# Altium project Battery Management System.PrjPcb (part 2 of 2)

## Sheet SH4 - MICROCONTROLLER.SchDoc: MCU
size Letter; DrawnBy: Ayesha Ebrahim; Revision: 1; SheetNumber: 4
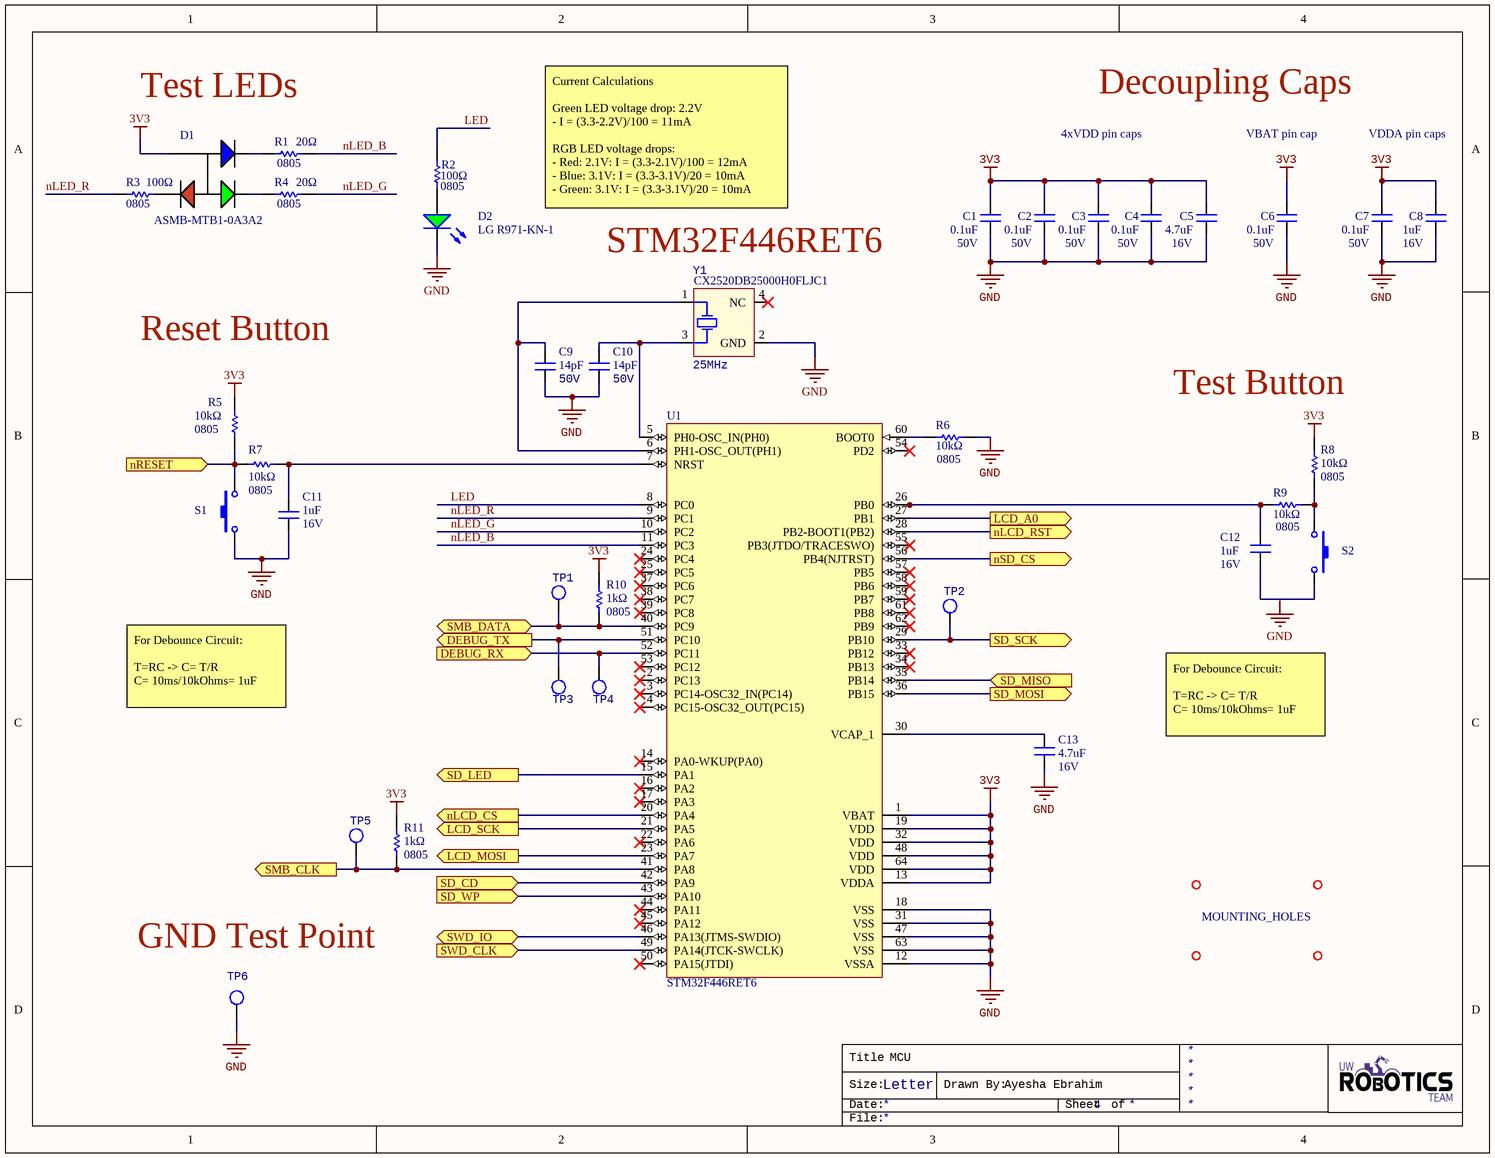
[diagram p3: SH4 - MICROCONTROLLER.SchDoc]

### Parts
C1  value 0.1uF  Voltage Rating: 50V  [CAPC2012X140N]  (hidden comment: CAP_0.1uF_50V_0805)
C2  value 0.1uF  Voltage Rating: 50V  [CAPC2012X140N]  (hidden comment: CAP_0.1uF_50V_0805)
C3  value 0.1uF  Voltage Rating: 50V  [CAPC2012X140N]  (hidden comment: CAP_0.1uF_50V_0805)
C4  value 0.1uF  Voltage Rating: 50V  [CAPC2012X140N]  (hidden comment: CAP_0.1uF_50V_0805)
C5  value 4.7uF  Voltage Rating: 16V  [CAPC2012X140N]  (hidden comment: CAP_4.7uF_16V_0805)
C6  value 0.1uF  Voltage Rating: 50V  [CAPC2012X140N]  (hidden comment: CAP_0.1uF_50V_0805)
C7  value 0.1uF  Voltage Rating: 50V  [CAPC2012X140N]  (hidden comment: CAP_0.1uF_50V_0805)
C8  value 1uF  Voltage Rating: 16V  [CAPC2012X140N]  (hidden comment: CAP_1uF_16V_0805)
C9  value 14pF  Voltage Rating (DC): 50V  [CAPC0603(1608)55_N]  (hidden comment: CL10C140JB8NNNC)
C10  value 14pF  Voltage Rating (DC): 50V  [CAPC0603(1608)55_N]  (hidden comment: CL10C140JB8NNNC)
C11  value 1uF  Voltage Rating: 16V  [CAPC2012X140N]  (hidden comment: CAP_1uF_16V_0805)
C12  value 1uF  Voltage Rating: 16V  [CAPC2012X140N]  (hidden comment: CAP_1uF_16V_0805)
C13  value 4.7uF  Voltage Rating: 16V  [CAPC2012X140N]  (hidden comment: CAP_4.7uF_16V_0805)
D1  Manufacturer Part Number 1: ASMB-MTB1-0A3A2  [LED_RGB]  (hidden comment: LED_RGB)
D2  Manufacturer Part Number 1: LG R971-KN-1  [LED_0805_LINE]  (hidden comment: DIO_LED_G)
MH1  MOUNTING_HOLES  [MOUNTING_HOLE]  (value not drawn)
MH2  MOUNTING_HOLES  [MOUNTING_HOLE]  (value not drawn)
MH3  MOUNTING_HOLES  [MOUNTING_HOLE]
MH4  MOUNTING_HOLES  [MOUNTING_HOLE]  (value not drawn)
R1  value 20Ω  Case Code (Imperial): 0805  [RESC2012X60N]  (hidden comment: RES_20Ω_0805)
R2  value 100Ω  Case Code (Imperial): 0805  [RESC2012X60N]  (hidden comment: RES_100Ω_0805)
R3  value 100Ω  Case Code (Imperial): 0805  [RESC2012X60N]  (hidden comment: RES_100Ω_0805)
R4  value 20Ω  Case Code (Imperial): 0805  [RESC2012X60N]  (hidden comment: RES_20Ω_0805)
R5  value 10kΩ  Case Code (Imperial): 0805  [RESC2012X60N]  (hidden comment: RES_10kΩ_0805)
R6  value 10kΩ  Case Code (Imperial): 0805  [RESC2012X60N]  (hidden comment: RES_10kΩ_0805)
R7  value 10kΩ  Case Code (Imperial): 0805  [RESC2012X60N]  (hidden comment: RES_10kΩ_0805)
R8  value 10kΩ  Case Code (Imperial): 0805  [RESC2012X60N]  (hidden comment: RES_10kΩ_0805)
R9  value 10kΩ  Case Code (Imperial): 0805  [RESC2012X60N]  (hidden comment: RES_10kΩ_0805)
R10  value 1kΩ  Case Code (Imperial): 0805  [RESC2012X60N]  (hidden comment: RES_1kΩ_0805)
R11  value 1kΩ  Case Code (Imperial): 0805  [RESC2012X60N]  (hidden comment: RES_1kΩ_0805)
S1  SW_TACTILE  [B3U-1000P]  (value not drawn)
S2  SW_TACTILE  [B3U-1000P]  (value not drawn)
TP1  TESTPOINT_LOOP  [TESTPOINT_LOOP]  (value not drawn)
TP2  TESTPOINT_LOOP  [TESTPOINT_LOOP]  (value not drawn)
TP3  TESTPOINT_LOOP  [TESTPOINT_LOOP]  (value not drawn)
TP4  TESTPOINT_LOOP  [TESTPOINT_LOOP]  (value not drawn)
TP5  TESTPOINT_LOOP  [TESTPOINT_LOOP]  (value not drawn)
TP6  TESTPOINT_LOOP  [TESTPOINT_LOOP]  (value not drawn)
U1  STM32F446RET6  [STM-LQFP64_L]
Y1  Manufacturer Part Number 1: CX2520DB25000H0FLJC1  Frequency: 25MHz  [SOIC254P1016X440-4N]  (hidden comment: CRYSTAL_25MHZ)

### Ports
DEBUG_RX (in), DEBUG_TX (out), LCD_A0 (out), LCD_MOSI (out), LCD_SCK (out), nLCD_CS (out), nLCD_RST (out), nRESET (in), nSD_CS (out), SD_CD (in), SD_LED (out), SD_MISO (in), SD_MOSI (out), SD_SCK (out), SD_WP (in), SMB_CLK (out), SMB_DATA (bidir), SWD_CLK (in), SWD_IO (bidir)

### Nets
3V3: C1.2 C2.2 C3.2 C4.2 C5.2 C6.2 C7.2 C8.2 D1.4 R5.2 R8.2 R10.2 R11.2 U1.1(VBAT) U1.13(VDDA) U1.19(VDD) U1.32(VDD) U1.48(VDD) U1.64(VDD)
GND: C1.1 C2.1 C3.1 C4.1 C5.1 C6.1 C7.1 C8.1 C9.1 C10.1 C11.1 C13.1 D2.2(K) R6.2 S1.1 TP6.1 U1.12(VSSA) U1.18(VSS) U1.31(VSS) U1.47(VSS) U1.63(VSS) Y1.2(GND)
DEBUG_RX: TP4.1 U1.52(PC11) ; port DEBUG_RX
DEBUG_TX: TP3.1 U1.51(PC10) ; port DEBUG_TX
LCD_A0: U1.27(PB1) ; port LCD_A0
LCD_MOSI: U1.23(PA7) ; port LCD_MOSI
LCD_SCK: U1.21(PA5) ; port LCD_SCK
LED: R2.2 U1.8(PC0)
nLCD_CS: U1.20(PA4) ; port nLCD_CS
nLCD_RST: U1.28(PB2-BOOT1(PB2)) ; port nLCD_RST
nLED_B: R1.2 U1.11(PC3)
nLED_G: R4.2 U1.10(PC2)
nLED_R: R3.1 U1.9(PC1)
nRESET: R5.1 R7.1 S1.2 ; port nRESET
nSD_CS: U1.56(PB4(NJTRST)) ; port nSD_CS
SD_CD: U1.42(PA9) ; port SD_CD
SD_LED: U1.15(PA1) ; port SD_LED
SD_MISO: U1.35(PB14) ; port SD_MISO
SD_MOSI: U1.36(PB15) ; port SD_MOSI
SD_SCK: TP2.1 U1.29(PB10) ; port SD_SCK
SD_WP: U1.43(PA10) ; port SD_WP
SMB_CLK: R11.1 TP5.1 U1.41(PA8) ; port SMB_CLK
SMB_DATA: R10.1 TP1.1 U1.40(PC9) ; port SMB_DATA
SWD_CLK: U1.49(PA14(JTCK-SWCLK)) ; port SWD_CLK
SWD_IO: U1.46(PA13(JTMS-SWDIO)) ; port SWD_IO
NetC9_2: C9.2 U1.6(PH1-OSC_OUT(PH1)) Y1.1(HOT)
NetC10_2: C10.2 U1.5(PH0-OSC_IN(PH0)) Y1.3(HOT)
NetC11_2: C11.2 R7.2 U1.7(NRST)
NetC12_1: C12.1 S2.2
NetC12_2: C12.2 R9.1 U1.26(PB0)
NetC13_2: C13.2 U1.30(VCAP_1)
NetD1_1: D1.1 R3.2
NetD1_2: D1.2 R4.1
NetD1_3: D1.3 R1.1
NetD2_1: D2.1(A) R2.1
NetR6_1: R6.1 U1.60(BOOT0)
NetR8_1: R8.1 R9.2 S2.1

Not connected (* = marked no-connect by the designer): U1 2(PC13)* 3(PC14-OSC32_IN(PC14))* 4(PC15-OSC32_OUT(PC15))* 14(PA0-WKUP(PA0))* 16(PA2)* 17(PA3)* 22(PA6)* 24(PC4)* 25(PC5)* 33(PB12)* 34(PB13)* 37(PC6)* 38(PC7)* 39(PC8)* 44(PA11)* 45(PA12)* 50(PA15(JTDI))* 53(PC12)* 54(PD2)* 55(PB3(JTDO/TRACESWO))* 57(PB5)* 58(PB6)* 59(PB7)* 61(PB8)* 62(PB9)*; Y1 4(NC)*

### Notes on the sheet
- Test LEDs
- Decoupling Caps
- 4xVDD pin caps
- VBAT pin cap
- VDDA pin caps
- Current Calculations
  Green LED voltage drop: 2.2V
  - I = (3.3-2.2V)/100 = 11mA
  RGB LED voltage drops:
  - Red: 2.1V: I = (3.3-2.1V)/100 = 12mA
  - Blue: 3.1V: I = (3.3-3.1V)/20 = 10mA
  - Green: 3.1V: I = (3.3-3.1V)/20 = 10mA
- (near Y1) STM32F446RET6
- Reset Button
- (near R8) Test Button
- For Debounce Circuit:
  T=RC -> C= T/R
  C= 10ms/10kOhms= 1uF
- GND Test Point
- Labels drawn without touching a wire or pin: GND
- Title
- Size:
- Date:
- Letter
- Drawn By:
- Sheet
- of
- File:

### Library data of the parts
C1-C4 C6 C7 = CAP_0.1uF_50V_0805: CAP CER 0.1UF 50V X7R 0805; Manufacturer 1: Murata Electronics; Manufacturer Part Number 1: GCD21BR71H104KA01L; Capacitance: 100nF; Tolerance: 10%; Mount: Surface Mount; Case/Package: 0805; Case Code (Metric): 2012; Case Code (Imperial): 0805; Min Operating Temperature: -55°C; Max Operating Temperature: 125°C; Dielectric: X7R; Termination: SMD/SMT; Length: 2mm; Height: 1.25mm; Width: 0.049inch; Thickness: 0.049inch; Depth: 1.25mm; Ratings: AEC-Q200; ComponentLink1URL: https://datasheet.ciiva.com/29537/c03e-29537701.pdf?src-supplier=Digi-Key; ComponentLink1Description: https://datasheet.ciiva.com/29537/c03e-29537701.pdf?src-supplier=Digi-Key; Supplier 1: Digi-Key; Supplier Part Number 1: 490-11955-1-ND
C5 C13 = CAP_4.7uF_16V_0805: CAP CER 4.7UF 16V X5R 0805; Manufacturer 1: Samsung Electro-Mechanics; Manufacturer Part Number 1: CL21A475KOFNNNE; Tolerance: 10%; Mount: Surface Mount; Case/Package: 0805; Case Code (Metric): 2012; Case Code (Imperial): 0805; Min Operating Temperature: -55°C; Max Operating Temperature: 85°C; Capacitance: 4.7uF; Dielectric: X5R; Termination: SMD/SMT; Supplier 1: Digi-Key; Supplier Part Number 1: 1276-1065-1-ND
C8 C11 C12 = CAP_1uF_16V_0805: CAP CER 1UF 16V X7R 0805; Manufacturer 1: Yageo; Manufacturer Part Number 1: CC0805KKX7R7BB105; Tolerance: 10%; Mount: Surface Mount; Case/Package: 0805; Case Code (Metric): 2012; Case Code (Imperial): 0805; Min Operating Temperature: -55°C; Max Operating Temperature: 125°C; Capacitance: 1uF; Dielectric: X7R; Termination: SMD/SMT; Supplier 1: Digi-Key; Supplier Part Number 1: 311-1365-1-ND
C9 C10 = CL10C140JB8NNNC: Cap Ceramic 14pF 50V C0G 5% SMD 0603 125C Cardboard T/R; Manufacturer 1: Samsung; Voltage Rating: 50V; Supplier Part Number 1: 1276-2187-1-ND; Supplier 1: Digi-Key; Manufacturer Part Number 1: CL10C140JB8NNNC; Stock 1: 187088; Pricing 1: 1=0.10000, 10=0.06700, 100=0.02980, 500=0.02130, 1000=0.01673 (USD); RoHS: Yes; Mount: Surface Mount; Case/Package: 0603; Case Code (Metric): 1608; Case Code (Imperial): 0603; Min Operating Temperature: -55°C; Max Operating Temperature: 125°C; Tolerance: 5%; Package Quantity: 1; Packaging: Tape and Reel; Dielectric: C0G; Length: 1.6mm; Height: 0.8mm; Width: 0.031inch; Depth: 0.8mm; Thickness: 0.035inch; Radiation Hardening: No; ComponentLink1URL: https://datasheet.ciiva.com/25782/cl10c140jb8nnnc-25782947.pdf?src-supplier=Digi-Key; ComponentLink1Description: https://datasheet.ciiva.com/25782/cl10c140jb8nnnc-25782947.pdf?src-supplier=Digi-Key; Capacitance: 14pF
D1 = LED_RGB: LED RGB DIFFUSED 4PLCC SMD; Manufacturer 1: Broadcom; Color: Blue,Green,Red; Lens Color: White; Viewing Angle: 115°; Lens Style: Round; Luminous Intensity: 350mcd; Dominant Wavelength: 470nm; Forward Voltage: 3.1V; Test Current: 20mA; Supplier 1: Digi-Key; Stock 1: 142531; Pricing 1: 1=0.60000, 10=0.47100, 100=0.30210, 500=0.25980, 1000=0.20059 (USD); RoHS: Yes; Mount: Surface Mount; Case/Package: PLCC; Number of Pins: 4; Packaging: Cut Tape; Lens Transparency: Diffused; Length: 3.2mm; Height: 1.9mm; Width: 2.8mm; REACH SVHC: No SVHC; ComponentLink1URL: http://www.farnell.com/datasheets/2111106.pdf?src-supplier=Farnell; ComponentLink1Description: http://www.farnell.com/datasheets/2111106.pdf?src-supplier=Farnell; ComponentLink2URL: https://docs.broadcom.com/docs/AV02-4194EN?src-supplier=Digi-Key; ComponentLink2Description: https://docs.broadcom.com/docs/AV02-4194EN?src-supplier=Digi-Key; ComponentLink3URL: http://www.farnell.com/datasheets/1801564.pdf?src-supplier=Element14; ComponentLink3Description: http://www.farnell.com/datasheets/1801564.pdf?src-supplier=Element14; ComponentLink4URL: http://www.farnell.com/datasheets/2111106.pdf?src-supplier=Newark; ComponentLink4Description: http://www.farnell.com/datasheets/2111106.pdf?src-supplier=Newark; Supplier Part Number 1: 516-3280-1-ND
D2 = DIO_LED_G: LED GREEN DIFFUSED 0805 SMD; Manufacturer 1: OSRAM; Forward Voltage Drop: 2.2V; Package: 0805 (2012 Metric); Supplier Part Number 1: 475-1410-1-ND; Supplier 1: Digi-Key; Mount: Surface Mount
MH1-MH4 = MOUNTING_HOLES: 6cm x 6cm
R1 R4 = RES_20Ω_0805: RES SMD 20 OHM 1% 1/8W 0805; Manufacturer 1: Yageo; Manufacturer Part Number 1: RC0805FR-0720RL; Resistance: 20; Power Rating: 125mW; Supplier 1: Digi-Key; Case Code (Metric): 2012; Min Operating Temperature: -55°C; Max Operating Temperature: 155°C; Tolerance: 1%; Termination: SMD/SMT; Supplier Part Number 1: 311-20.0CRCT-ND
R2 R3 = RES_100Ω_0805: RES SMD 100 OHM 1% 1/8W 0805; Manufacturer 1: Yageo; Manufacturer Part Number 1: RC0805FR-07100RL; Power Rating: 125mW; Supplier 1: Digi-Key; Mount: Surface Mount; Case Code (Metric): 2012; Supplier Part Number 1: 311-100CRCT-ND
R5-R9 = RES_10kΩ_0805: RES SMD 10K OHM 1% 1/8W 0805; Manufacturer 1: Yageo; Manufacturer Part Number 1: RC0805FR-0710KL; Power Rating: 125mW; Supplier 1: Digi-Key; Case Code (Metric): 2012; Min Operating Temperature: -55°C; Max Operating Temperature: 155°C; Resistance: 10K; Tolerance: 1%; Termination: SMD/SMT; Supplier Part Number 1: 311-10.0KCRCT-ND
R10 R11 = RES_1kΩ_0805: RES SMD 1K OHM 1% 1/8W 0805; Manufacturer 1: Yageo; Manufacturer Part Number 1: RC0805FR-071KL; Power Rating: 125mW; Supplier 1: Digi-Key; Case Code (Metric): 2012; Min Operating Temperature: -55°C; Max Operating Temperature: 155°C; Resistance: 1K; Tolerance: 1%; Termination: SMD/SMT; Supplier Part Number 1: 311-1.00KCRCT-ND
S1 S2 = SW_TACTILE: Tactile Switch (Grey); Manufacturer 1: Omron Electronics Inc-EMC Div; Manufacturer Part Number 1: B3U-1000P; Supplier 1: Digi-Key; Supplier Part Number 1: SW1020CT-ND; Mount: Surface Mount
TP1-TP6 = TESTPOINT_LOOP: Loop testpoint through-hole pad; Manufacturer Part Number 1: 5002; Manufacturer 1: Keystone Electronics; Supplier Part Number 1: 36-5002-ND; Supplier 1: Digi-Key; Mount: Through Hole
U1 = MCU_STM32F446RET6: ARM Cortex-M4 32-bit MCU+FPU, 512 KB Flash, 128 KB Internal RAM, 50 I/Os, 64-Pin LQFP, -40 to 85 degC, Tray; I/Os (High Current): 50; Supply Voltage(Vcc) min (V): 1.7; Operating Frequency(F) (Processor speed) (MHz): 180; D/A Converter: 2; Internal RAM Size (kB): 128; FLASH Size (Prog) (kB): 512; Core: ARM Cortex-M4; ComponentLink1Description: Manufacturer URL; Package Reference: 64-Pin Low-profile Quad Flat Package, Body 10 x 10 mm, Pitch 0.5 mm; ComponentLink2URL: http://www.st.com/st-web-ui/static/active/en/resource/technical/document/datasheet/DM00141306.pdf; Packing: Tray; DatasheetVersion: Rev. 6; ComponentLink1URL: http://www.st.com/; ComponentLink2Description: Datasheet; Package Description: LQFP64; Mounting Technology: Surface Mount; Supplier Part Number 1: 497-15376-ND; Supplier 1: Digi-Key
Y1 = CRYSTAL_25MHZ: CRYSTAL 25.0000MHZ 12PF SMD; Manufacturer 1: Kyocera AVX; ESR (Equivalent Series Resistance): 80R; Frequency Stability: 15ppm; Frequency Tolerance: 10ppm; ComponentLink1Description: https://media.digikey.com/pdf/Data%20Sheets/AVX%20PDFs/CX2520DB_USY1M-H1-16429-00_Spec.pdf?src-supplier=Digi-Key; ComponentLink1URL: https://media.digikey.com/pdf/Data%20Sheets/AVX%20PDFs/CX2520DB_USY1M-H1-16429-00_Spec.pdf?src-supplier=Digi-Key; Supplier 1: Digi-Key; Supplier Part Number 1: 1253-1724-1-ND; Stock 1: 11741; Pricing 1: 1=0.72000, 10=0.63300, 50=0.59120, 100=0.52250, 500=0.49500, 1000=0.41250 (USD); RoHS: Yes; Mount: Surface Mount; Case/Package: SMD/SMT; Min Operating Temperature: -30°C; Max Operating Temperature: 85°C; Packaging: Tape and Reel; Load Capacitance: 12pF; Length: 0.098inch; Height: 0.022inch; Width: 0.079inch; Ratings: AEC-Q200

## Sheet SH5 - LCD DISPLAY.SchDoc: LCD
size Letter; Author: Ayesha Ebrahim; DrawnBy: Ayesha Ebrahim; SheetNumber: 3
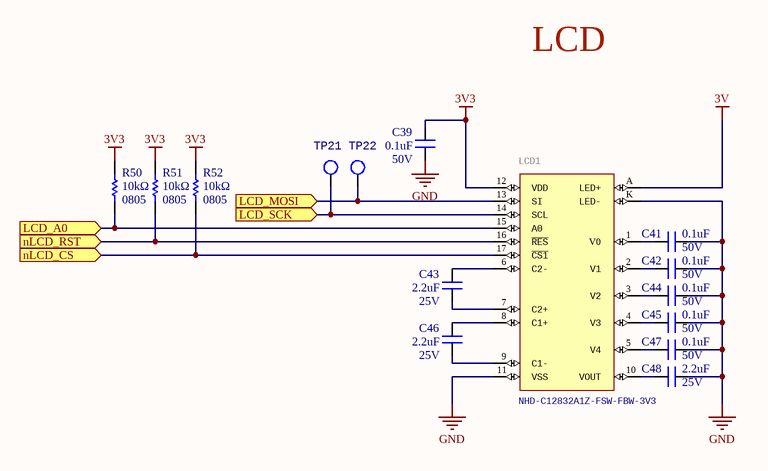
[diagram p4: SH5 - LCD DISPLAY.SchDoc]

### Parts
C39  value 0.1uF  Voltage Rating: 50V  [CAPC2012X140N]  (hidden comment: CAP_0.1uF_50V_0805)
C41  value 0.1uF  Voltage Rating: 50V  [CAPC2012X140N]  (hidden comment: CAP_0.1uF_50V_0805)
C42  value 0.1uF  Voltage Rating: 50V  [CAPC2012X140N]  (hidden comment: CAP_0.1uF_50V_0805)
C43  value 2.2uF  Voltage Rating: 25V  [CAPC2012X140N]  (hidden comment: CAP_2.2uF_25V_0805)
C44  value 0.1uF  Voltage Rating: 50V  [CAPC2012X140N]  (hidden comment: CAP_0.1uF_50V_0805)
C45  value 0.1uF  Voltage Rating: 50V  [CAPC2012X140N]  (hidden comment: CAP_0.1uF_50V_0805)
C46  value 2.2uF  Voltage Rating: 25V  [CAPC2012X140N]  (hidden comment: CAP_2.2uF_25V_0805)
C47  value 0.1uF  Voltage Rating: 50V  [CAPC2012X140N]  (hidden comment: CAP_0.1uF_50V_0805)
C48  value 2.2uF  Voltage Rating: 25V  [CAPC2012X140N]  (hidden comment: CAP_2.2uF_25V_0805)
LCD1  NHD-C12832A1Z-FSW-FBW-3V3  [NHDC12832A1ZFSWFBW3V3]
R50  value 10kΩ  Case Code (Imperial): 0805  [RESC2012X60N]  (hidden comment: RES_10kΩ_0805)
R51  value 10kΩ  Case Code (Imperial): 0805  [RESC2012X60N]  (hidden comment: RES_10kΩ_0805)
R52  value 10kΩ  Case Code (Imperial): 0805  [RESC2012X60N]  (hidden comment: RES_10kΩ_0805)
TP21  TESTPOINT_LOOP  [TESTPOINT_LOOP]  (value not drawn)
TP22  TESTPOINT_LOOP  [TESTPOINT_LOOP]  (value not drawn)

### Ports
LCD_A0 (in), LCD_MOSI (in), LCD_SCK (in), nLCD_CS (in), nLCD_RST (in)

### Nets
3V: LCD1.A(LED+)
3V3: C39.1 LCD1.12(VDD) R50.2 R51.2 R52.2
GND: C39.2 C41.1 C42.1 C44.1 C45.1 C47.1 C48.1 LCD1.11(VSS) LCD1.K(LED-)
LCD_A0: LCD1.15(A0) R50.1 ; port LCD_A0
LCD_MOSI: LCD1.13(SI) TP22.1 ; port LCD_MOSI
LCD_SCK: LCD1.14(SCL) TP21.1 ; port LCD_SCK
nLCD_CS: LCD1.17(~{CS1}) R52.1 ; port nLCD_CS
nLCD_RST: LCD1.16(~{RES}) R51.1 ; port nLCD_RST
NetC41_2: C41.2 LCD1.1(V0)
NetC42_2: C42.2 LCD1.2(V1)
NetC43_1: C43.1 LCD1.7(C2+)
NetC43_2: C43.2 LCD1.6(C2-)
NetC44_2: C44.2 LCD1.3(V2)
NetC45_2: C45.2 LCD1.4(V3)
NetC46_1: C46.1 LCD1.9(C1-)
NetC46_2: C46.2 LCD1.8(C1+)
NetC47_2: C47.2 LCD1.5(V4)
NetC48_2: C48.2 LCD1.10(VOUT)

### Notes on the sheet
- LCD
- Title
- Size:
- Date:
- Letter
- Drawn By:
- Sheet
- of
- File:

### Library data of the parts
C39 C41 C42 C44 C45 C47 = CAP_0.1uF_50V_0805: as C1 on sheet SH4 - MICROCONTROLLER; Mount: Surface Mount; Case/Package: 0805; Case Code (Metric): 2012; Case Code (Imperial): 0805; Min Operating Temperature: -55°C; Max Operating Temperature: 125°C; Dielectric: X7R; Termination: SMD/SMT; Length: 2mm; Height: 1.25mm; Width: 0.049inch; Thickness: 0.049inch; Depth: 1.25mm; Ratings: AEC-Q200; ComponentLink1URL: https://datasheet.ciiva.com/29537/c03e-29537701.pdf?src-supplier=Digi-Key; ComponentLink1Description: https://datasheet.ciiva.com/29537/c03e-29537701.pdf?src-supplier=Digi-Key; Supplier 1: Digi-Key; Supplier Part Number 1: 490-11955-1-ND
C43 C46 C48 = CAP_2.2uF_25V_0805: CAP CER 2.2UF 25V X7R 0805; Manufacturer 1: Murata Electronics; Manufacturer Part Number 1: GRM21BR71E225KA73L; Capacitance: 2200nF; Tolerance: 10%; Mount: Surface Mount; Case/Package: 0805; Case Code (Metric): 2012; Case Code (Imperial): 0805; Min Operating Temperature: -55°C; Max Operating Temperature: 125°C; Dielectric: X7R; Termination: SMD/SMT; Length: 2mm; Height: 1.25mm; Width: 0.049inch; Thickness: 0.049inch; Depth: 1.25mm; Ratings: AEC-Q200; Supplier 1: Digi-Key; Supplier Part Number 1: 490-3331-2-ND
LCD1 = NHD-C12832A1Z-FSW-FBW-3V3: LCD COG GRAPHIC 128X32; Manufacturer 1: Newhaven Display Intl; Supplier 1: Digi-Key; Supplier Part Number 1: NHD-C12832A1Z-FSW-FBW-3V3-ND; Manufacturer Part Number 1: NHD-C12832A1Z-FSW-FBW-3V3
R50-R52 = RES_10kΩ_0805: as R5 on sheet SH4 - MICROCONTROLLER; Supplier 1: Digi-Key; Case Code (Metric): 2012; Min Operating Temperature: -55°C; Max Operating Temperature: 155°C; Resistance: 10K; Tolerance: 1%; Termination: SMD/SMT; Supplier Part Number 1: 311-10.0KCRCT-ND
TP21 TP22 = TESTPOINT_LOOP: as TP1 on sheet SH4 - MICROCONTROLLER; Supplier Part Number 1: 36-5002-ND; Supplier 1: Digi-Key; Mount: Through Hole

## Sheet SH7 - SD CARD CONNECTOR.SchDoc: SD Card
size Letter; DrawnBy: Ayesha Ebrahim; SheetNumber: 6; SheetTotal: 6
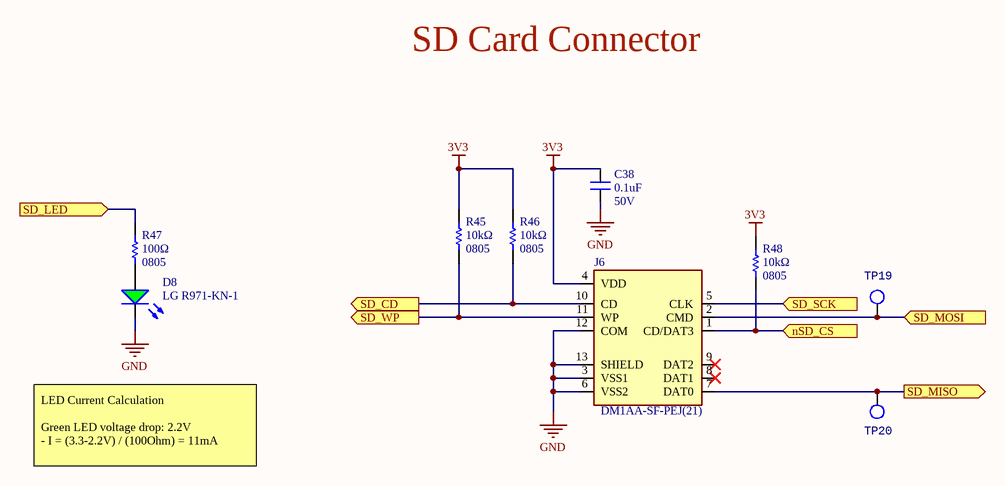
[diagram p5: SH7 - SD CARD CONNECTOR.SchDoc]

### Parts
C38  value 0.1uF  Voltage Rating: 50V  [CAPC2012X140N]  (hidden comment: CAP_0.1uF_50V_0805)
D8  Manufacturer Part Number 1: LG R971-KN-1  [LED_0805_LINE]  (hidden comment: DIO_LED_G)
J6  Manufacturer Part Number 1: DM1AA-SF-PEJ(21)  [HRS_DM1AA-SF-PEJ(21)]  (hidden comment: SD_CARD_CON)
R45  value 10kΩ  Case Code (Imperial): 0805  [RESC2012X60N]  (hidden comment: RES_10kΩ_0805)
R46  value 10kΩ  Case Code (Imperial): 0805  [RESC2012X60N]  (hidden comment: RES_10kΩ_0805)
R47  value 100Ω  Case Code (Imperial): 0805  [RESC2012X60N]  (hidden comment: RES_100Ω_0805)
R48  value 10kΩ  Case Code (Imperial): 0805  [RESC2012X60N]  (hidden comment: RES_10kΩ_0805)
TP19  TESTPOINT_LOOP  [TESTPOINT_LOOP]  (value not drawn)
TP20  TESTPOINT_LOOP  [TESTPOINT_LOOP]  (value not drawn)

### Ports
nSD_CS (in), SD_CD (out), SD_LED (in), SD_MISO (out), SD_MOSI (in), SD_SCK (in), SD_WP (out)

### Nets
3V3: C38.2 J6.4(VDD) R45.2 R46.2 R48.2
GND: C38.1 D8.2(K) J6.3(VSS1) J6.6(VSS2) J6.12(COM) J6.13(SHIELD)
nSD_CS: J6.1(CD/DAT3) R48.1 ; port nSD_CS
SD_CD: J6.10(CD) R46.1 ; port SD_CD
SD_LED: R47.2 ; port SD_LED
SD_MISO: J6.7(DAT0) TP20.1 ; port SD_MISO
SD_MOSI: J6.2(CMD) TP19.1 ; port SD_MOSI
SD_SCK: J6.5(CLK) ; port SD_SCK
SD_WP: J6.11(WP) R45.1 ; port SD_WP
NetD8_1: D8.1(A) R47.1

Not connected (* = marked no-connect by the designer): J6 8(DAT1)* 9(DAT2)*

### Notes on the sheet
- SD Card Connector
- LED Current Calculation
  Green LED voltage drop: 2.2V
  - I = (3.3-2.2V) / (100Ohm) = 11mA
- Title
- Size:
- Date:
- Letter
- Drawn By:
- Sheet
- of
- File:

### Library data of the parts
C38 = CAP_0.1uF_50V_0805: as C1 on sheet SH4 - MICROCONTROLLER; Mount: Surface Mount; Case/Package: 0805; Case Code (Metric): 2012; Case Code (Imperial): 0805; Min Operating Temperature: -55°C; Max Operating Temperature: 125°C; Dielectric: X7R; Termination: SMD/SMT; Length: 2mm; Height: 1.25mm; Width: 0.049inch; Thickness: 0.049inch; Depth: 1.25mm; Ratings: AEC-Q200; ComponentLink1URL: https://datasheet.ciiva.com/29537/c03e-29537701.pdf?src-supplier=Digi-Key; ComponentLink1Description: https://datasheet.ciiva.com/29537/c03e-29537701.pdf?src-supplier=Digi-Key; Supplier 1: Digi-Key; Supplier Part Number 1: 490-11955-1-ND
D8 = DIO_LED_G: as D2 on sheet SH4 - MICROCONTROLLER; Package: 0805 (2012 Metric); Supplier Part Number 1: 475-1410-1-ND; Supplier 1: Digi-Key; Mount: Surface Mount
J6 = SD_CARD_CON: 12 _9 + 3_ Position Card Connector Secure Digital - SD Surface Mount, Right Angle Gold; Manufacturer 1: Hirose Electric Co Ltd; Supplier 1: Digi-Key; Supplier Part Number 1: HR845CT-ND; Mount: Surface Mount; Card Type: SD
R45 R46 R48 = RES_10kΩ_0805: as R5 on sheet SH4 - MICROCONTROLLER; Supplier 1: Digi-Key; Case Code (Metric): 2012; Min Operating Temperature: -55°C; Max Operating Temperature: 155°C; Resistance: 10K; Tolerance: 1%; Termination: SMD/SMT; Supplier Part Number 1: 311-10.0KCRCT-ND
R47 = RES_100Ω_0805: as R2 on sheet SH4 - MICROCONTROLLER; Supplier 1: Digi-Key; Mount: Surface Mount; Case Code (Metric): 2012; Supplier Part Number 1: 311-100CRCT-ND
TP19 TP20 = TESTPOINT_LOOP: as TP1 on sheet SH4 - MICROCONTROLLER; Supplier Part Number 1: 36-5002-ND; Supplier 1: Digi-Key; Mount: Through Hole

## Nets that join several sheets
3V: SH1 - POWER (C51.2 U4.5), SH5 - LCD DISPLAY (LCD1.A)
3V3: SH1 - POWER (9 pins), SH2 - CONNECTORS (J5.1), SH4 - MICROCONTROLLER (19 pins), SH5 - LCD DISPLAY (5 pins), SH7 - SD CARD CONNECTOR (5 pins)
GND: SH1 - POWER (14 pins), SH2 - CONNECTORS (5 pins), SH3 - BATTERY MANAGER (31 pins), SH4 - MICROCONTROLLER (22 pins), SH5 - LCD DISPLAY (9 pins), SH7 - SD CARD CONNECTOR (6 pins)
VBAT: SH1 - POWER (C16.2 R49.1 TP8.1 U2.7), SH2 - CONNECTORS (D9.2 J1.7 J3.1), SH3 - BATTERY MANAGER (7 pins)
CELL_1S: SH2 - CONNECTORS (J1.2), SH3 - BATTERY MANAGER (R35.1)
CELL_2S: SH2 - CONNECTORS (J1.3), SH3 - BATTERY MANAGER (R33.1)
CELL_3S: SH2 - CONNECTORS (J1.4), SH3 - BATTERY MANAGER (R32.1)
CELL_4S: SH2 - CONNECTORS (J1.5), SH3 - BATTERY MANAGER (R31.1)
CELL_5S: SH2 - CONNECTORS (J1.6), SH3 - BATTERY MANAGER (R30.1)
DEBUG_RX: SH2 - CONNECTORS (J5.3), SH4 - MICROCONTROLLER (TP4.1 U1.52)
DEBUG_TX: SH2 - CONNECTORS (J5.2), SH4 - MICROCONTROLLER (TP3.1 U1.51)
LCD_A0: SH4 - MICROCONTROLLER (U1.27), SH5 - LCD DISPLAY (LCD1.15 R50.1)
LCD_MOSI: SH4 - MICROCONTROLLER (U1.23), SH5 - LCD DISPLAY (LCD1.13 TP22.1)
LCD_SCK: SH4 - MICROCONTROLLER (U1.21), SH5 - LCD DISPLAY (LCD1.14 TP21.1)
nLCD_CS: SH4 - MICROCONTROLLER (U1.20), SH5 - LCD DISPLAY (LCD1.17 R52.1)
nLCD_RST: SH4 - MICROCONTROLLER (U1.28), SH5 - LCD DISPLAY (LCD1.16 R51.1)
nRESET: SH2 - CONNECTORS (J5.8), SH4 - MICROCONTROLLER (R5.1 R7.1 S1.2)
nSD_CS: SH4 - MICROCONTROLLER (U1.56), SH7 - SD CARD CONNECTOR (J6.1 R48.1)
PACK+: SH2 - CONNECTORS (J2.2), SH3 - BATTERY MANAGER (9 pins)
PACK-: SH2 - CONNECTORS (J2.1), SH3 - BATTERY MANAGER (C33.1 R43.1 R44.2)
SD_CD: SH4 - MICROCONTROLLER (U1.42), SH7 - SD CARD CONNECTOR (J6.10 R46.1)
SD_LED: SH4 - MICROCONTROLLER (U1.15), SH7 - SD CARD CONNECTOR (R47.2)
SD_MISO: SH4 - MICROCONTROLLER (U1.35), SH7 - SD CARD CONNECTOR (J6.7 TP20.1)
SD_MOSI: SH4 - MICROCONTROLLER (U1.36), SH7 - SD CARD CONNECTOR (J6.2 TP19.1)
SD_SCK: SH4 - MICROCONTROLLER (TP2.1 U1.29), SH7 - SD CARD CONNECTOR (J6.5)
SD_WP: SH4 - MICROCONTROLLER (U1.43), SH7 - SD CARD CONNECTOR (J6.11 R45.1)
SMB_CLK: SH2 - CONNECTORS (J4.3), SH3 - BATTERY MANAGER (R36.1), SH4 - MICROCONTROLLER (R11.1 TP5.1 U1.41)
SMB_DATA: SH2 - CONNECTORS (J4.2), SH3 - BATTERY MANAGER (R39.1), SH4 - MICROCONTROLLER (R10.1 TP1.1 U1.40)
SWD_CLK: SH2 - CONNECTORS (J5.7), SH4 - MICROCONTROLLER (U1.49)
SWD_IO: SH2 - CONNECTORS (J5.6), SH4 - MICROCONTROLLER (U1.46)

## Assembly variants
Production: not fitted C2 C3 C5 C6 R13